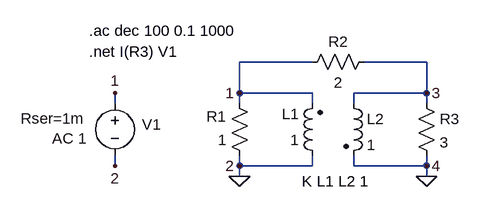
[diagram p0: schematic TS6_1.asc]
TS6_1.asc, the LTspice schematic file:
Version 4
SHEET 1 880 680
WIRE -16 48 -128 48
WIRE 160 48 64 48
WIRE -128 96 -128 48
WIRE -16 96 -128 96
WIRE 160 96 160 48
WIRE 160 96 48 96
WIRE -320 112 -320 96
WIRE -128 112 -128 96
WIRE -16 112 -16 96
WIRE 48 112 48 96
WIRE 160 112 160 96
WIRE -320 208 -320 192
WIRE -128 208 -128 192
WIRE -16 208 -16 192
WIRE -16 208 -128 208
WIRE 48 208 48 192
WIRE 160 208 160 192
WIRE 160 208 48 208
WIRE -128 224 -128 208
WIRE 160 224 160 208
FLAG -128 224 0
FLAG 160 224 0
FLAG -128 96 1
FLAG -128 208 2
FLAG 160 96 3
FLAG 160 208 4
FLAG -320 208 2
FLAG -320 96 1
SYMBOL ind2 0 208 R180
WINDOW 0 36 80 Left 2
WINDOW 3 36 40 Left 2
SYMATTR InstName L1
SYMATTR Value 1
SYMATTR Type ind
SYMBOL ind2 32 96 R0
SYMATTR InstName L2
SYMATTR Value 1
SYMATTR Type ind
SYMBOL res -112 208 R180
WINDOW 0 36 76 Left 2
WINDOW 3 36 40 Left 2
SYMATTR InstName R1
SYMATTR Value 1
SYMBOL res 144 96 R0
SYMATTR InstName R3
SYMATTR Value 3
SYMBOL res 80 32 R90
WINDOW 0 0 56 VBottom 2
WINDOW 3 32 56 VTop 2
SYMATTR InstName R2
SYMATTR Value 2
SYMBOL voltage -320 96 R0
WINDOW 0 42 48 Left 2
WINDOW 123 -97 70 Left 2
WINDOW 39 -145 39 Left 2
SYMATTR InstName V1
SYMATTR Value2 AC 1
SYMATTR SpiceLine Rser=1m
SYMATTR Value ""
TEXT -32 232 Left 2 !K L1 L2 1
TEXT -360 0 Left 2 !.ac dec 100 0.1 1000
TEXT -360 32 Left 2 !.net I(R3) V1

The netlist it stands for:
* TS6_1.asc
L1 0 1 1
L2 3 0 1
R1 0 1 1
R3 3 0 3
R2 3 1 2
V1 1 0 AC 1 Rser=1m
K L1 L2 1
.ac dec 100 0.1 1000
.net I(R3) V1
.backanno
.end